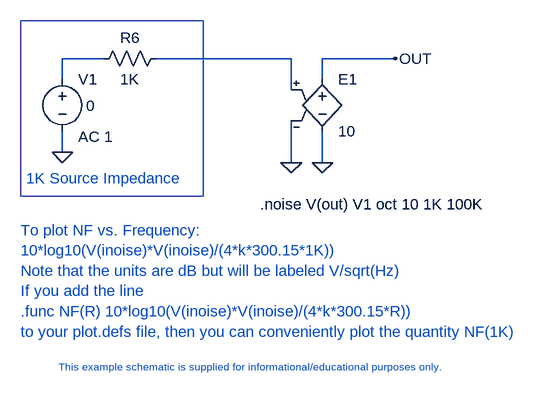
[diagram p0: schematic noiseless.asc]
noiseless.asc, the LTspice schematic file:
Version 4
SHEET 1 3088 1688
WIRE 1632 1104 1568 1104
WIRE 1920 1104 1712 1104
WIRE 2080 1104 1968 1104
WIRE 1568 1136 1568 1104
WIRE 1968 1136 1968 1104
WIRE 1920 1152 1920 1104
WIRE 1568 1248 1568 1216
WIRE 1920 1264 1920 1200
WIRE 1968 1264 1968 1216
FLAG 1568 1248 0
FLAG 2080 1104 OUT
FLAG 1968 1264 0
FLAG 1920 1264 0
SYMBOL voltage 1568 1120 R0
WINDOW 3 37 57 Left 2
WINDOW 123 24 104 Left 2
SYMATTR Value 0
SYMATTR Value2 AC 1
SYMATTR InstName V1
SYMBOL res 1728 1088 R90
WINDOW 0 0 56 VBottom 2
WINDOW 3 32 56 VTop 2
SYMATTR InstName R6
SYMATTR Value 1K
SYMBOL e 1968 1120 R0
SYMATTR InstName E1
SYMATTR Value 10
TEXT 1872 1328 Left 2 !.noise V(out) V1 oct 10 1K 100K
TEXT 1504 1368 Left 2 ;To plot NF vs. Frequency:\n10*log10(V(inoise)*V(inoise)/(4*k*300.15*1K))\nNote that the units are dB but will be labeled V/sqrt(Hz)\nIf you add the line\n.func NF(R) 10*log10(V(inoise)*V(inoise)/(4*k*300.15*R))\nto your plot.defs file, then you can conveniently plot the quantity NF(1K)
TEXT 1512 1288 Left 2 ;1K Source Impedance
TEXT 1848 1568 Top 1 ;This example schematic is supplied for informational/educational purposes only.
LINE Normal 1785 1046 1504 1046
LINE Normal 1785 1316 1785 1046
LINE Normal 1785 1316 1504 1316
LINE Normal 1504 1316 1504 1046

The netlist it stands for:
* noiseless.asc
V1 N001 0 0 AC 1
R6 N002 N001 1K
E1 OUT 0 N002 0 10
.noise V(out) V1 oct 10 1K 100K
* To plot NF vs. Frequency:
* 10*log10(V(inoise)*V(inoise)/(4*k*300.15*1K))
* Note that the units are dB but will be labeled V/sqrt(Hz)
* If you add the line
* .func NF(R) 10*log10(V(inoise)*V(inoise)/(4*k*300.15*R))
* to your plot.defs file, then you can conveniently plot the quantity NF(1K)
* 1K Source Impedance
* This example schematic is supplied for informational/educational purposes only.
.backanno
.end